# EAGLE design elysium_v0_1 (EAGLE 6.5.0)
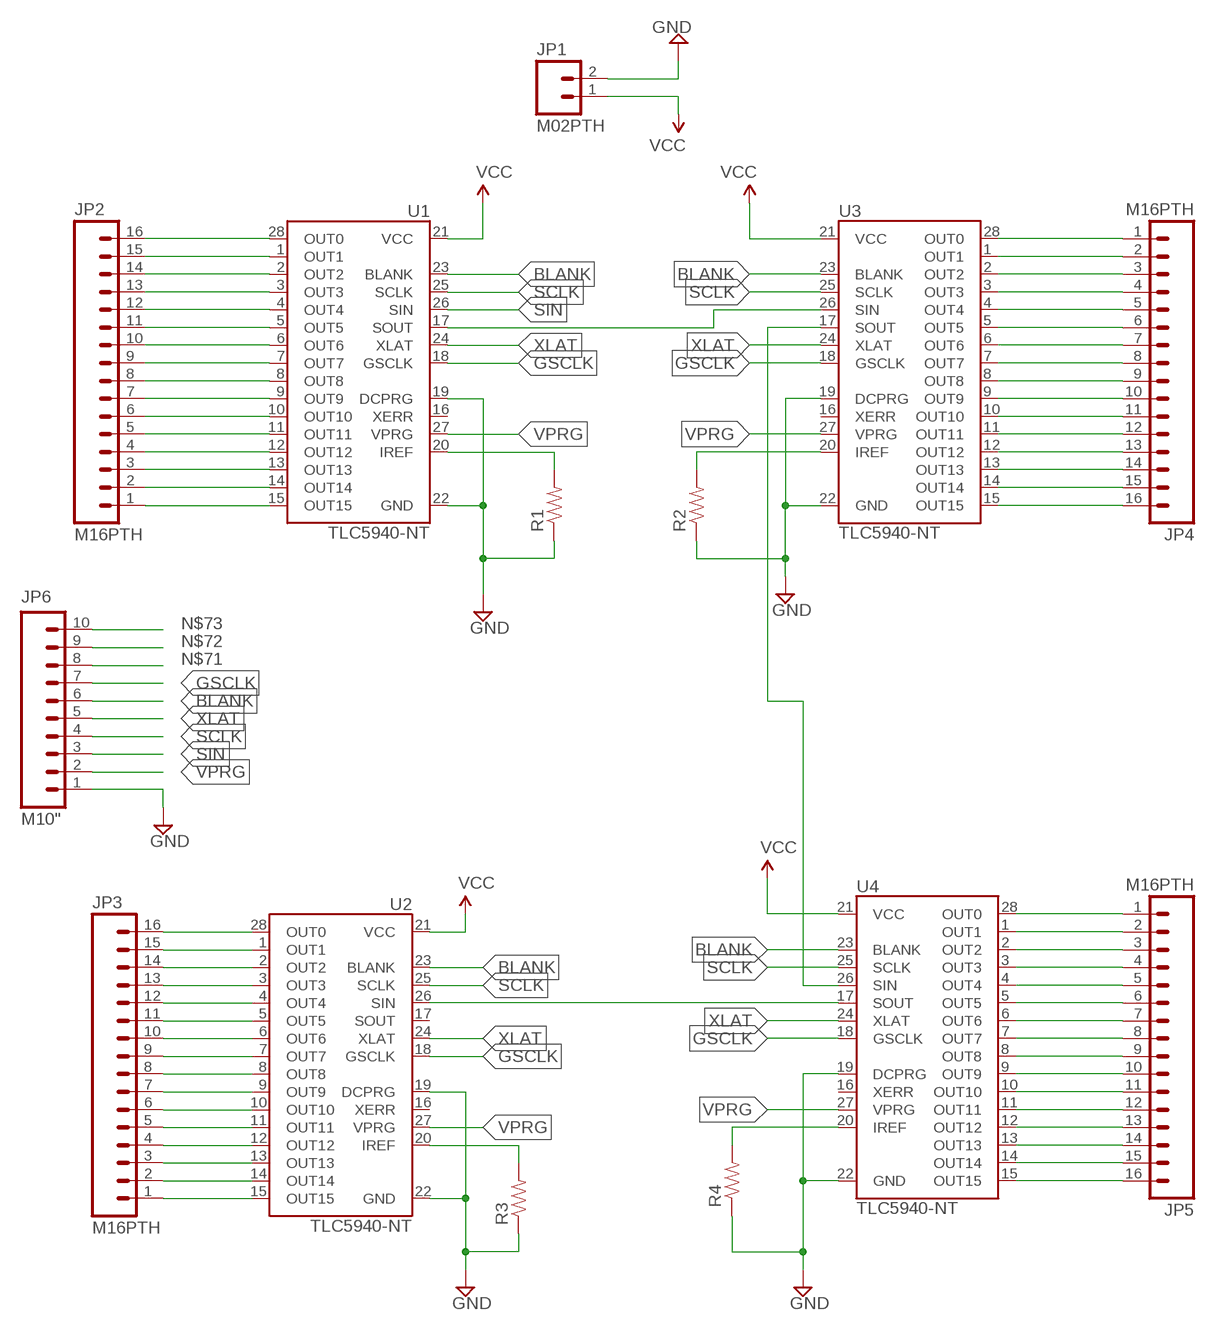
[diagram p0: schematic, sheet 1]

## Parts
JP1  M02PTH  [1X02]
JP2  M16PTH  [1X16]
JP3  M16PTH  [1X16]
JP4  M16PTH  [1X16]
JP5  M16PTH  [1X16]
JP6  M10"  [1X10]
R1  RESISTOREZ  [AXIAL-0.3EZ]
R2  RESISTOREZ  [AXIAL-0.3EZ]
R3  RESISTOREZ  [AXIAL-0.3EZ]
R4  RESISTOREZ  [AXIAL-0.3EZ]
U1  TLC5940-NT  [DIL28-3]
U2  TLC5940-NT  [DIL28-3]
U3  TLC5940-NT  [DIL28-3]
U4  TLC5940-NT  [DIL28-3]

## Nets
BLANK: JP6.6 U1.23(BLANK) U2.23(BLANK) U3.23(BLANK) U4.23(BLANK)
GND: JP1.2 JP6.1 R1.P$1 R2.P$1 R3.P$1 R4.P$1 U1.19(DCPRG) U1.22(GND) U2.19(DCPRG) U2.22(GND) U3.19(DCPRG) U3.22(GND) U4.19(DCPRG) U4.22(GND)
GSCLK: JP6.7 U1.18(GSCLK) U2.18(GSCLK) U3.18(GSCLK) U4.18(GSCLK)
N$1: JP2.16 U1.28(OUT0)
N$2: JP2.15 U1.1(OUT1)
N$3: JP2.14 U1.2(OUT2)
N$4: JP2.13 U1.3(OUT3)
N$5: JP2.12 U1.4(OUT4)
N$6: JP2.11 U1.5(OUT5)
N$7: JP2.10 U1.6(OUT6)
N$8: JP2.9 U1.7(OUT7)
N$9: JP2.8 U1.8(OUT8)
N$10: JP2.7 U1.9(OUT9)
N$11: JP2.6 U1.10(OUT10)
N$12: JP2.5 U1.11(OUT11)
N$13: JP2.4 U1.12(OUT12)
N$14: JP2.3 U1.13(OUT13)
N$15: JP2.2 U1.14(OUT14)
N$16: JP2.1 U1.15(OUT15)
N$17: JP4.1 U3.28(OUT0)
N$18: JP4.2 U3.1(OUT1)
N$19: JP4.3 U3.2(OUT2)
N$20: JP4.4 U3.3(OUT3)
N$21: JP4.5 U3.4(OUT4)
N$22: JP4.6 U3.5(OUT5)
N$23: JP4.7 U3.6(OUT6)
N$24: JP4.8 U3.7(OUT7)
N$25: JP4.9 U3.8(OUT8)
N$26: JP4.10 U3.9(OUT9)
N$27: JP4.11 U3.10(OUT10)
N$28: JP4.12 U3.11(OUT11)
N$29: JP4.13 U3.12(OUT12)
N$30: JP4.14 U3.13(OUT13)
N$31: JP4.15 U3.14(OUT14)
N$32: JP4.16 U3.15(OUT15)
N$33: JP3.16 U2.28(OUT0)
N$34: JP3.15 U2.1(OUT1)
N$35: JP3.14 U2.2(OUT2)
N$36: JP3.13 U2.3(OUT3)
N$37: JP3.12 U2.4(OUT4)
N$38: JP3.11 U2.5(OUT5)
N$39: JP3.10 U2.6(OUT6)
N$40: JP3.9 U2.7(OUT7)
N$41: JP3.8 U2.8(OUT8)
N$42: JP3.7 U2.9(OUT9)
N$43: JP3.6 U2.10(OUT10)
N$44: JP3.5 U2.11(OUT11)
N$45: JP3.4 U2.12(OUT12)
N$46: JP3.3 U2.13(OUT13)
N$47: JP3.2 U2.14(OUT14)
N$48: JP3.1 U2.15(OUT15)
N$49: JP5.1 U4.28(OUT0)
N$50: JP5.2 U4.1(OUT1)
N$51: JP5.3 U4.2(OUT2)
N$52: JP5.4 U4.3(OUT3)
N$53: JP5.5 U4.4(OUT4)
N$54: JP5.6 U4.5(OUT5)
N$55: JP5.7 U4.6(OUT6)
N$56: JP5.8 U4.7(OUT7)
N$57: JP5.9 U4.8(OUT8)
N$58: JP5.10 U4.9(OUT9)
N$59: JP5.11 U4.10(OUT10)
N$60: JP5.12 U4.11(OUT11)
N$61: JP5.13 U4.12(OUT12)
N$62: JP5.14 U4.13(OUT13)
N$63: JP5.15 U4.14(OUT14)
N$64: JP5.16 U4.15(OUT15)
N$65: U1.17(SOUT) U3.26(SIN)
N$66: U3.17(SOUT) U4.26(SIN)
N$67: U2.26(SIN) U4.17(SOUT)
N$68: R1.P$2 U1.20(IREF)
N$70: R2.P$2 U3.20(IREF)
N$71: JP6.8
N$72: JP6.9
N$73: JP6.10
N$75: R3.P$2 U2.20(IREF)
N$77: R4.P$2 U4.20(IREF)
SCLK: JP6.4 U1.25(SCLK) U2.25(SCLK) U3.25(SCLK) U4.25(SCLK)
SIN: JP6.3 U1.26(SIN)
VCC: JP1.1 U1.21(VCC) U2.21(VCC) U3.21(VCC) U4.21(VCC)
VPRG: JP6.2 U1.27(VPRG) U2.27(VPRG) U3.27(VPRG) U4.27(VPRG)
XLAT: JP6.5 U1.24(XLAT) U2.24(XLAT) U3.24(XLAT) U4.24(XLAT)
Unconnected: U1.16(XERR) U2.16(XERR) U2.17(SOUT) U3.16(XERR) U4.16(XERR)

## Library data of the parts
JP1 = SparkFun-Connectors:M02: Standard 2-pin 0.1" header. Use with - straight break away headers ( PRT-00116) - right angle break away headers (PRT-00553) - swiss pins (PRT-00743) - machine pins (PRT-00117) - female headers (PRT-00115) Molex polarized connector foot print use with: PRT-08233 with associated crimp pins and housings. 2.54_SCREWTERM for use with PRT-10571. 3.5mm Screw Terminal footprints for PRT-08084 5mm Screw Terminal footprints for use with PRT-08433
JP2-JP5 = SparkFun-Connectors:M16: 1x16 .1" header
JP6 = SparkFun-Connectors:M10: Header 10 Standard 10-pin 0.1" header. Use with straight break away headers (SKU : PRT-00116), right angle break away headers (PRT-00553), swiss pins (PRT-00743), machine pins (PRT-00117), and female headers (PRT-00115).
R1-R4 = SparkFun-Resistors:RESISTOR: Resistor Basic schematic elements and footprints for 0603, 1206, and PTH resistors.
U1-U4 = SparkFun-DigitalIC:TLC5940: 16-channel LED Driver with Dot Correction and Grayscale PWM Control The TLC5940 is a 16-channel, constant-current sink LED driver. Each channel has an individually adjustable 4096-step grayscale PWM brightness control and a 64-step, constant-current sink (dot correction). The dot correction adjusts the brightness variations between LED channels and other LED drivers. The dot correction data is stored in an integrated EEPROM. Both grayscale control and dot correction are accessible via a serial interface. A single external resistor sets the maximum current value of all 16 channels. Packages: 28-pin HTSSOP 32-pin 5x5mm QFN 28-pin DIP

## Board
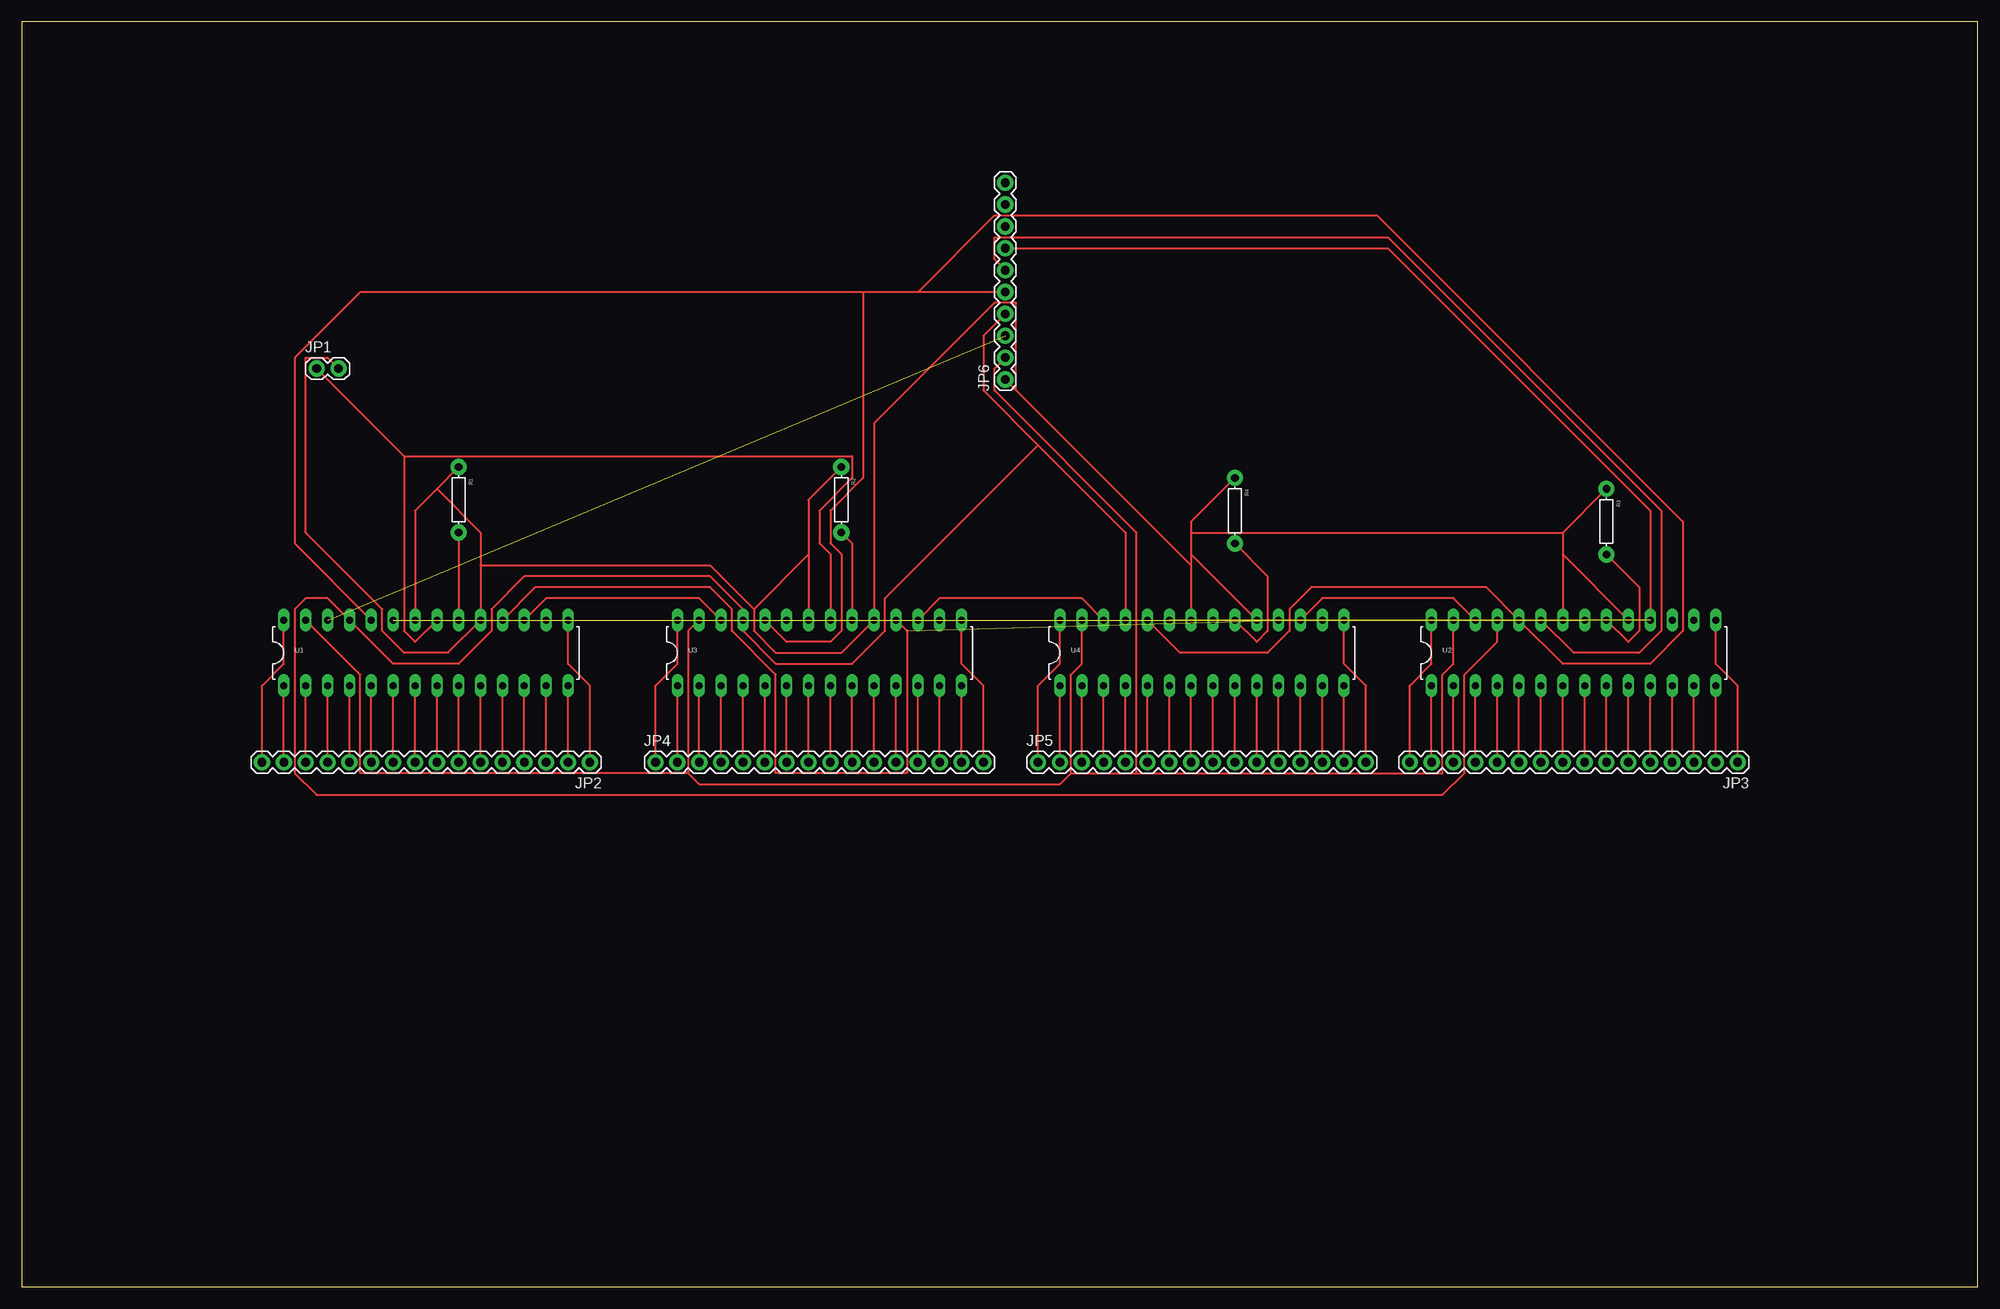
[diagram p1: board, top side]
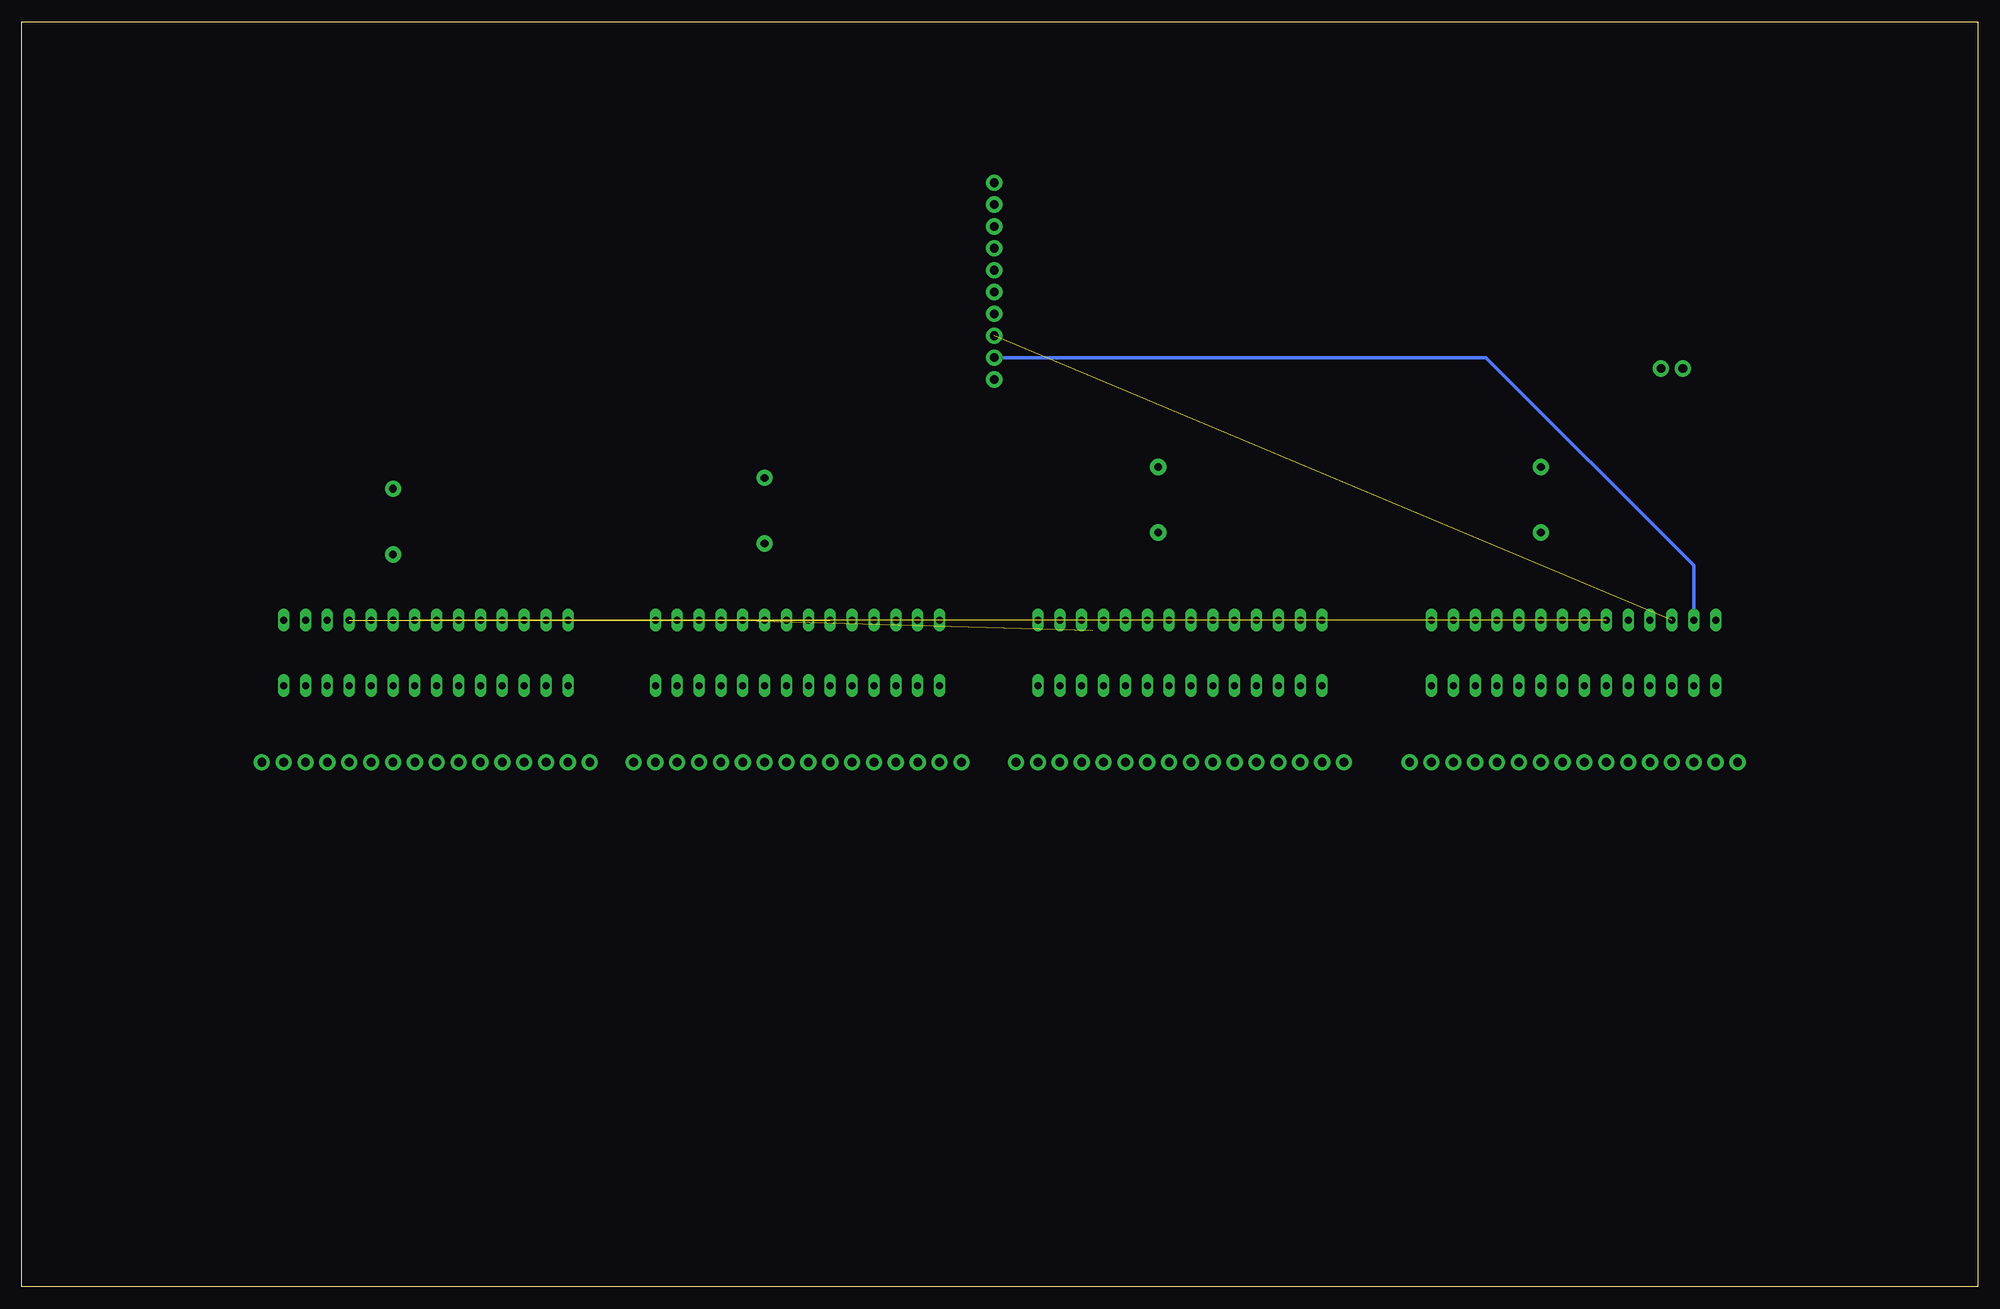
[diagram p2: board, bottom side, seen from below]

Size 227.31 x 146.99 mm. Coordinates in mm from the lower left corner, seen from the top.
Outline: 0,0 227.31,0 227.31,146.99 0,146.99 0,0
Copper layers (1*16): Top 0.035mm / dielectric 1.5mm / Bottom 0.035mm
Design rules "default": minimum track width 10mil, minimum drill 24mil, track to track 8mil, track to pad 8mil, pad to pad 8mil, via to via 8mil, smd to smd 8mil, copper to edge 40mil, drill to drill 8mil, minimum pad ring 10mil, minimum via ring 8mil, stop-mask expansion 4mil, vias tented up to drill 0mil, thermal gap 10mil

### Footprints (pad centres in the part's own frame; a part is rotated, then mirrored left to right if it is on the bottom)
1X02 = drill 1.016 pad 1.88: 1 0,0; 2 2.54,0
1X16 = drill 1.016 pad 1.88: 1 0,0; 2 2.54,0; 3 5.08,0; 4 7.62,0; 5 10.16,0; 6 12.7,0; 7 15.24,0; 8 17.78,0; 9 20.32,0; 10 22.86,0; 11 25.4,0; 12 27.94,0; 13 30.48,0; 14 33.02,0; 15 35.56,0; 16 38.1,0
1X10 = drill 1.016 pad 1.88: 1 0,0; 2 2.54,0; 3 5.08,0; 4 7.62,0; 5 10.16,0; 6 12.7,0; 7 15.24,0; 8 17.78,0; 9 20.32,0; 10 22.86,0
AXIAL-0.3EZ = drill 0.9 pad 1.88: P$1 -3.81,0; P$2 3.81,0
DIL28-3 = drill 0.813 long: 1 -16.51,-3.81; 2 -13.97,-3.81; 3 -11.43,-3.81; 4 -8.89,-3.81; 5 -6.35,-3.81; 6 -3.81,-3.81; 7 -1.27,-3.81; 8 1.27,-3.81; 9 3.81,-3.81; 10 6.35,-3.81; 11 8.89,-3.81; 12 11.43,-3.81; 13 13.97,-3.81; 14 16.51,-3.81; 15 16.51,3.81; 16 13.97,3.81; 17 11.43,3.81; 18 8.89,3.81; 19 6.35,3.81; 20 3.81,3.81; 21 1.27,3.81; 22 -1.27,3.81; 23 -3.81,3.81; 24 -6.35,3.81; 25 -8.89,3.81; 26 -11.43,3.81; 27 -13.97,3.81; 28 -16.51,3.81

### Placement (x,y rotation side)
JP1  34.29,106.68 0 top
JP2  66.04,60.96 180 top
JP3  199.39,60.96 180 top
JP4  73.66,60.96 0 top
JP5  118.11,60.96 0 top
JP6  114.3,105.41 90 top
R1  50.8,91.44 270 top
R2  95.25,91.44 270 top
R3  184.15,88.9 270 top
R4  140.97,90.17 270 top
U1  46.99,73.66 0 top
U2  180.34,73.66 0 top
U3  92.71,73.66 0 top
U4  137.16,73.66 0 top

### Tracks (layer width: path | path; a pad name or v marks a point on that pad's centre or on a via)
BLANK  (3 unrouted)
  Top 0.254: U2.23 180.34,73.66 187.96,73.66 190.5,76.2 190.5,90.17 158.75,121.92 113.03,121.92 113.03,119.38 JP6.6
GND
  Top 0.254: 91.44,85.09 91.44,91.44 R2.P$1 | 91.44,85.09 U3.22 | 85.09,78.74 85.09,76.2 87.63,73.66 95.25,73.66 U3.19 99.06,100.33 113.03,114.3 115.57,114.3 115.57,104.14 | 91.44,85.09 85.09,78.74 | U1.22 45.72,90.17 48.26,92.71 | R1.P$1 48.26,92.71 | 53.34,83.82 53.34,87.63 48.26,92.71 | 53.34,83.82 U1.19 49.53,73.66 44.45,73.66 41.91,76.2 41.91,78.74 33.02,87.63 33.02,107.95 35.56,107.95 JP1.2 | 85.09,78.74 80.01,83.82 53.34,83.82 | 179.07,87.63 179.07,85.09 | 179.07,85.09 U2.22 | R3.P$1 179.07,87.63 | 179.07,85.09 U2.19 | 135.89,87.63 135.89,88.9 R4.P$1 | 135.89,87.63 135.89,85.09 | 135.89,85.09 135.89,83.82 | 135.89,83.82 U4.22 | 135.89,85.09 U4.19 | 135.89,83.82 115.57,104.14 | 115.57,104.14 JP6.1 | 135.89,87.63 179.07,87.63
GSCLK  (2 unrouted)
  Top 0.254: U1.18 59.69,81.28 80.01,81.28 82.55,78.74 82.55,76.2 87.63,71.12 87.63,59.69 102.87,59.69 102.87,76.2 U3.18 | U2.18 189.23,90.17 158.75,120.65 JP6.7
N$1
  Top 0.254: U1.28 30.48,72.39 27.94,69.85 JP2.16
N$2
  Top 0.254: JP2.15 U1.1
N$3
  Top 0.254: JP2.14 U1.2
N$4
  Top 0.254: JP2.13 U1.3
N$5
  Top 0.254: JP2.12 U1.4
N$6
  Top 0.254: JP2.11 U1.5
N$7
  Top 0.254: JP2.10 U1.6
N$8
  Top 0.254: JP2.9 U1.7
N$9
  Top 0.254: JP2.8 U1.8
N$10
  Top 0.254: JP2.7 U1.9
N$11
  Top 0.254: JP2.6 U1.10
N$12
  Top 0.254: JP2.5 U1.11
N$13
  Top 0.254: JP2.4 U1.12
N$14
  Top 0.254: JP2.3 U1.13
N$15
  Top 0.254: JP2.2 U1.14
N$16
  Top 0.254: U1.15 63.5,72.39 66.04,69.85 JP2.1
N$17
  Top 0.254: U3.28 76.2,72.39 73.66,69.85 JP4.1
N$18
  Top 0.254: JP4.2 U3.1
N$19
  Top 0.254: JP4.3 U3.2
N$20
  Top 0.254: JP4.4 U3.3
N$21
  Top 0.254: JP4.5 U3.4
N$22
  Top 0.254: JP4.6 U3.5
N$23
  Top 0.254: JP4.7 U3.6
N$24
  Top 0.254: JP4.8 U3.7
N$25
  Top 0.254: JP4.9 U3.8
N$26
  Top 0.254: JP4.10 U3.9
N$27
  Top 0.254: JP4.11 U3.10
N$28
  Top 0.254: JP4.12 U3.11
N$29
  Top 0.254: JP4.13 U3.12
N$30
  Top 0.254: JP4.14 U3.13
N$31
  Top 0.254: JP4.15 U3.14
N$32
  Top 0.254: U3.15 109.22,72.39 111.76,69.85 JP4.16
N$33
  Top 0.254: U2.28 163.83,72.39 161.29,69.85 JP3.16
N$34
  Top 0.254: JP3.15 U2.1
N$35
  Top 0.254: JP3.14 U2.2
N$36
  Top 0.254: JP3.13 U2.3
N$37
  Top 0.254: JP3.12 U2.4
N$38
  Top 0.254: JP3.11 U2.5
N$39
  Top 0.254: JP3.10 U2.6
N$40
  Top 0.254: JP3.9 U2.7
N$41
  Top 0.254: JP3.8 U2.8
N$42
  Top 0.254: JP3.7 U2.9
N$43
  Top 0.254: JP3.6 U2.10
N$44
  Top 0.254: JP3.5 U2.11
N$45
  Top 0.254: JP3.4 U2.12
N$46
  Top 0.254: JP3.3 U2.13
N$47
  Top 0.254: JP3.2 U2.14
N$48
  Top 0.254: U2.15 196.85,72.39 199.39,69.85 JP3.1
N$49
  Top 0.254: U4.28 120.65,72.39 118.11,69.85 JP5.1
N$50
  Top 0.254: JP5.2 U4.1
N$51
  Top 0.254: JP5.3 U4.2
N$52
  Top 0.254: JP5.4 U4.3
N$53
  Top 0.254: JP5.5 U4.4
N$54
  Top 0.254: JP5.6 U4.5
N$55
  Top 0.254: JP5.7 U4.6
N$56
  Top 0.254: JP5.8 U4.7
N$57
  Top 0.254: JP5.9 U4.8
N$58
  Top 0.254: JP5.10 U4.9
N$59
  Top 0.254: JP5.11 U4.10
N$60
  Top 0.254: JP5.12 U4.11
N$61
  Top 0.254: JP5.13 U4.12
N$62
  Top 0.254: JP5.14 U4.13
N$63
  Top 0.254: JP5.15 U4.14
N$64
  Top 0.254: U4.15 153.67,72.39 156.21,69.85 JP5.16
N$65
  Top 0.254: U1.17 60.96,80.01 78.74,80.01 U3.26
N$66
  Top 0.254: U3.17 106.68,80.01 123.19,80.01 U4.26
N$67
  Top 0.254: U4.17 151.13,80.01 166.37,80.01 U2.26
N$68
  Top 0.254: R1.P$2 U1.20
N$70
  Top 0.254: U3.20 96.52,86.36 R2.P$2
N$75
  Top 0.254: U2.20 186.69,74.93 187.96,76.2 187.96,81.28 R3.P$2
N$77
  Top 0.254: U4.20 143.51,74.93 144.78,76.2 144.78,82.55 R4.P$2
SCLK
  Top 0.254: U4.25 128.27,87.63 118.11,97.79 | 118.11,97.79 111.76,104.14 111.76,110.49 JP6.4 | U2.25 171.45,74.93 167.64,71.12 167.64,59.69 165.1,57.15 34.29,57.15 31.75,59.69 31.75,78.74 33.02,80.01 35.56,80.01 U1.25 43.18,72.39 50.8,72.39 54.61,76.2 54.61,78.74 58.42,82.55 80.01,82.55 83.82,78.74 U3.25 83.82,76.2 87.63,72.39 96.52,72.39 100.33,76.2 100.33,80.01 118.11,97.79
SIN  (1 unrouted)
VCC  (2 unrouted)
  Top 0.254: U1.21 45.72,74.93 44.45,76.2 44.45,96.52 | JP1.1 44.45,96.52 | U3.21 93.98,85.09 92.71,86.36 92.71,90.17 96.52,93.98 96.52,96.52 44.45,96.52
VPRG
  Top 0.254: U1.27 39.37,71.12 39.37,59.69 77.47,59.69 | 77.47,59.69 77.47,76.2 U3.27 | U4.27 123.19,72.39 121.92,71.12 121.92,59.69 | 121.92,59.69 120.65,58.42 78.74,58.42 77.47,59.69 | U2.27 166.37,72.39 165.1,71.12 165.1,59.69 129.54,59.69 | 121.92,59.69 129.54,59.69 | JP6.2 113.03,106.68 113.03,104.14 129.54,87.63 129.54,59.69
  Bottom 0.406: U1.27 33.02,83.82 57.15,107.95 JP6.2
XLAT
  Top 0.254: U4.24 134.62,73.66 144.78,73.66 147.32,76.2 147.32,78.74 149.86,81.28 170.18,81.28 U2.24 179.07,72.39 189.23,72.39 193.04,76.2 193.04,88.9 157.48,124.46 113.03,124.46 104.14,115.57 | U1.24 31.75,86.36 31.75,107.95 39.37,115.57 97.79,115.57 | JP6.5 104.14,115.57 | 104.14,115.57 97.79,115.57 | U3.24 88.9,74.93 93.98,74.93 95.25,76.2 95.25,85.09 93.98,86.36 93.98,90.17 97.79,93.98 97.79,115.57